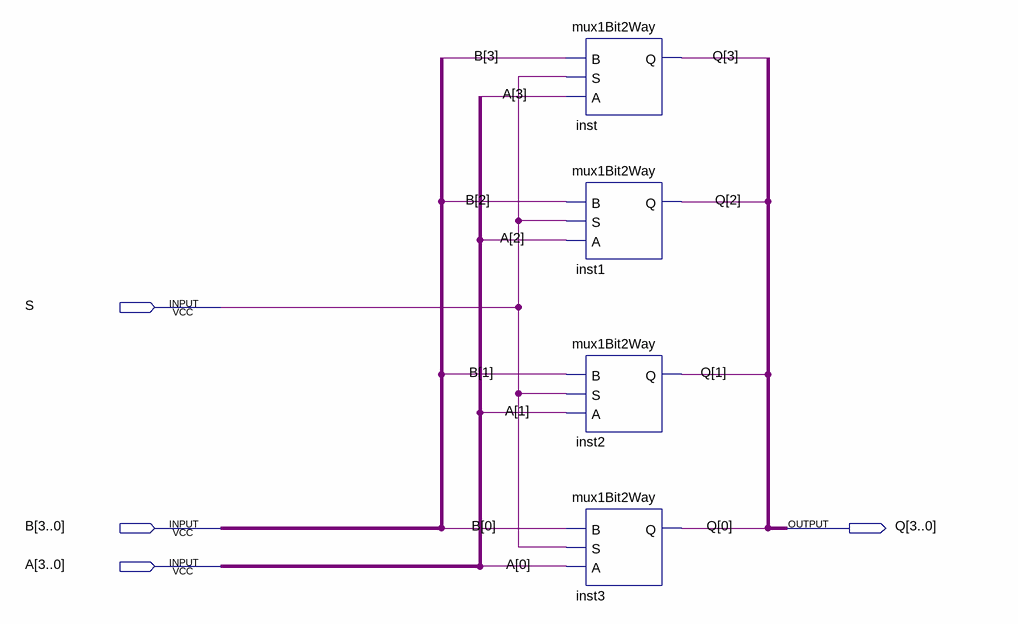
[diagram p0: schematic sheet]
// Quartus schematic mux4Bit2Way.bdf as structural Verilog: 4 symbols, 4 pins
module mux4Bit2Way (
  input  S,
  input  [3:0] B,
  input  [3:0] A,
  output [3:0] Q
);

  mux1Bit2Way inst (.B(B[3]), .S(S), .A(A[3]), .Q(Q[3]));
  mux1Bit2Way inst1 (.B(B[2]), .S(S), .A(A[2]), .Q(Q[2]));
  mux1Bit2Way inst2 (.B(B[1]), .S(S), .A(A[1]), .Q(Q[1]));
  mux1Bit2Way inst3 (.B(B[0]), .S(S), .A(A[0]), .Q(Q[0]));
endmodule
